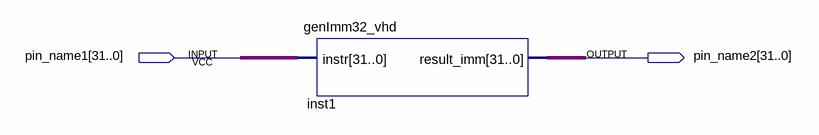
[diagram p0: schematic sheet]
// Quartus schematic RiscV_Processor.bdf as structural Verilog: 1 symbols, 2 pins
module RiscV_Processor (
  input  [31:0] pin_name1,
  output [31:0] pin_name2
);

  genImm32_vhd inst1 (.instr(pin_name1), .result_imm(pin_name2));
endmodule
